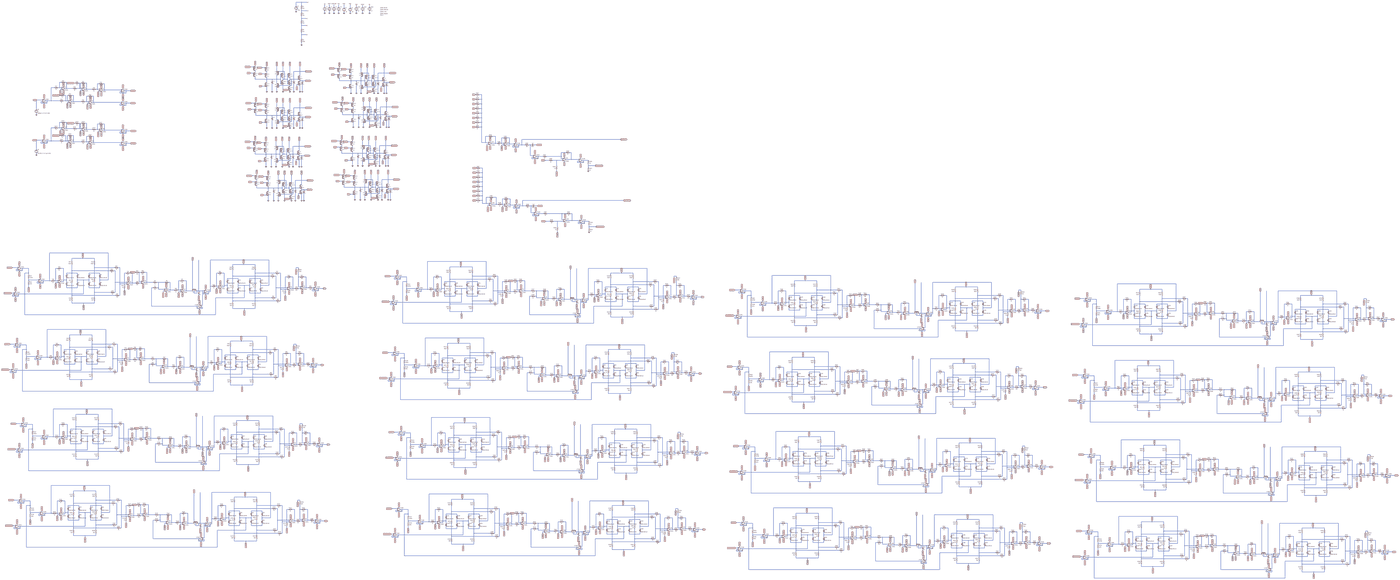
[diagram p0: schematic OZ_8_bounded_curves.asc, whole sheet]
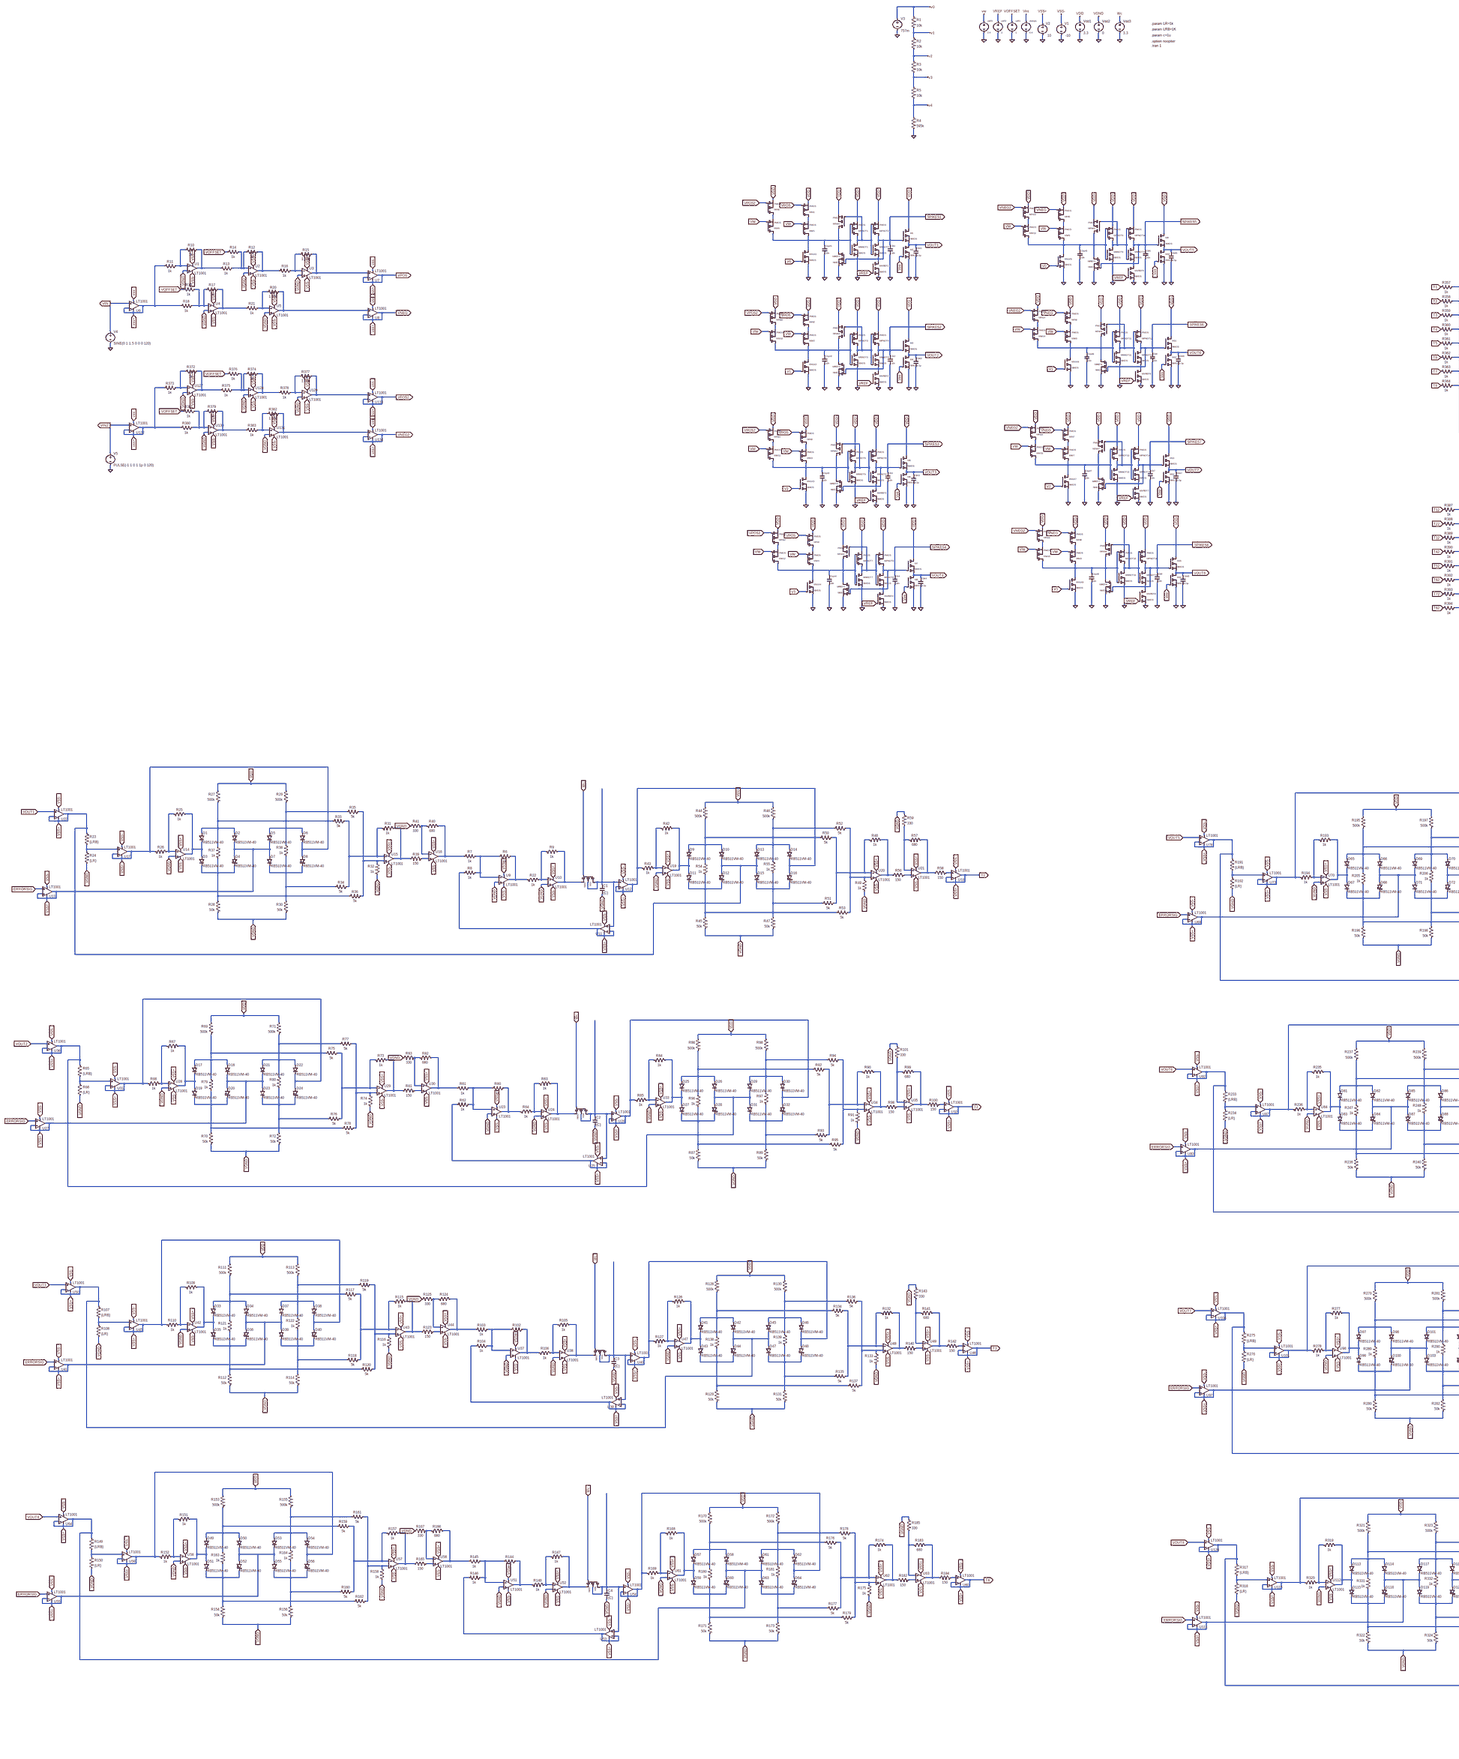
[diagram p1: schematic OZ_8_bounded_curves.asc, part, row 1 of 1, column 1 of 3]
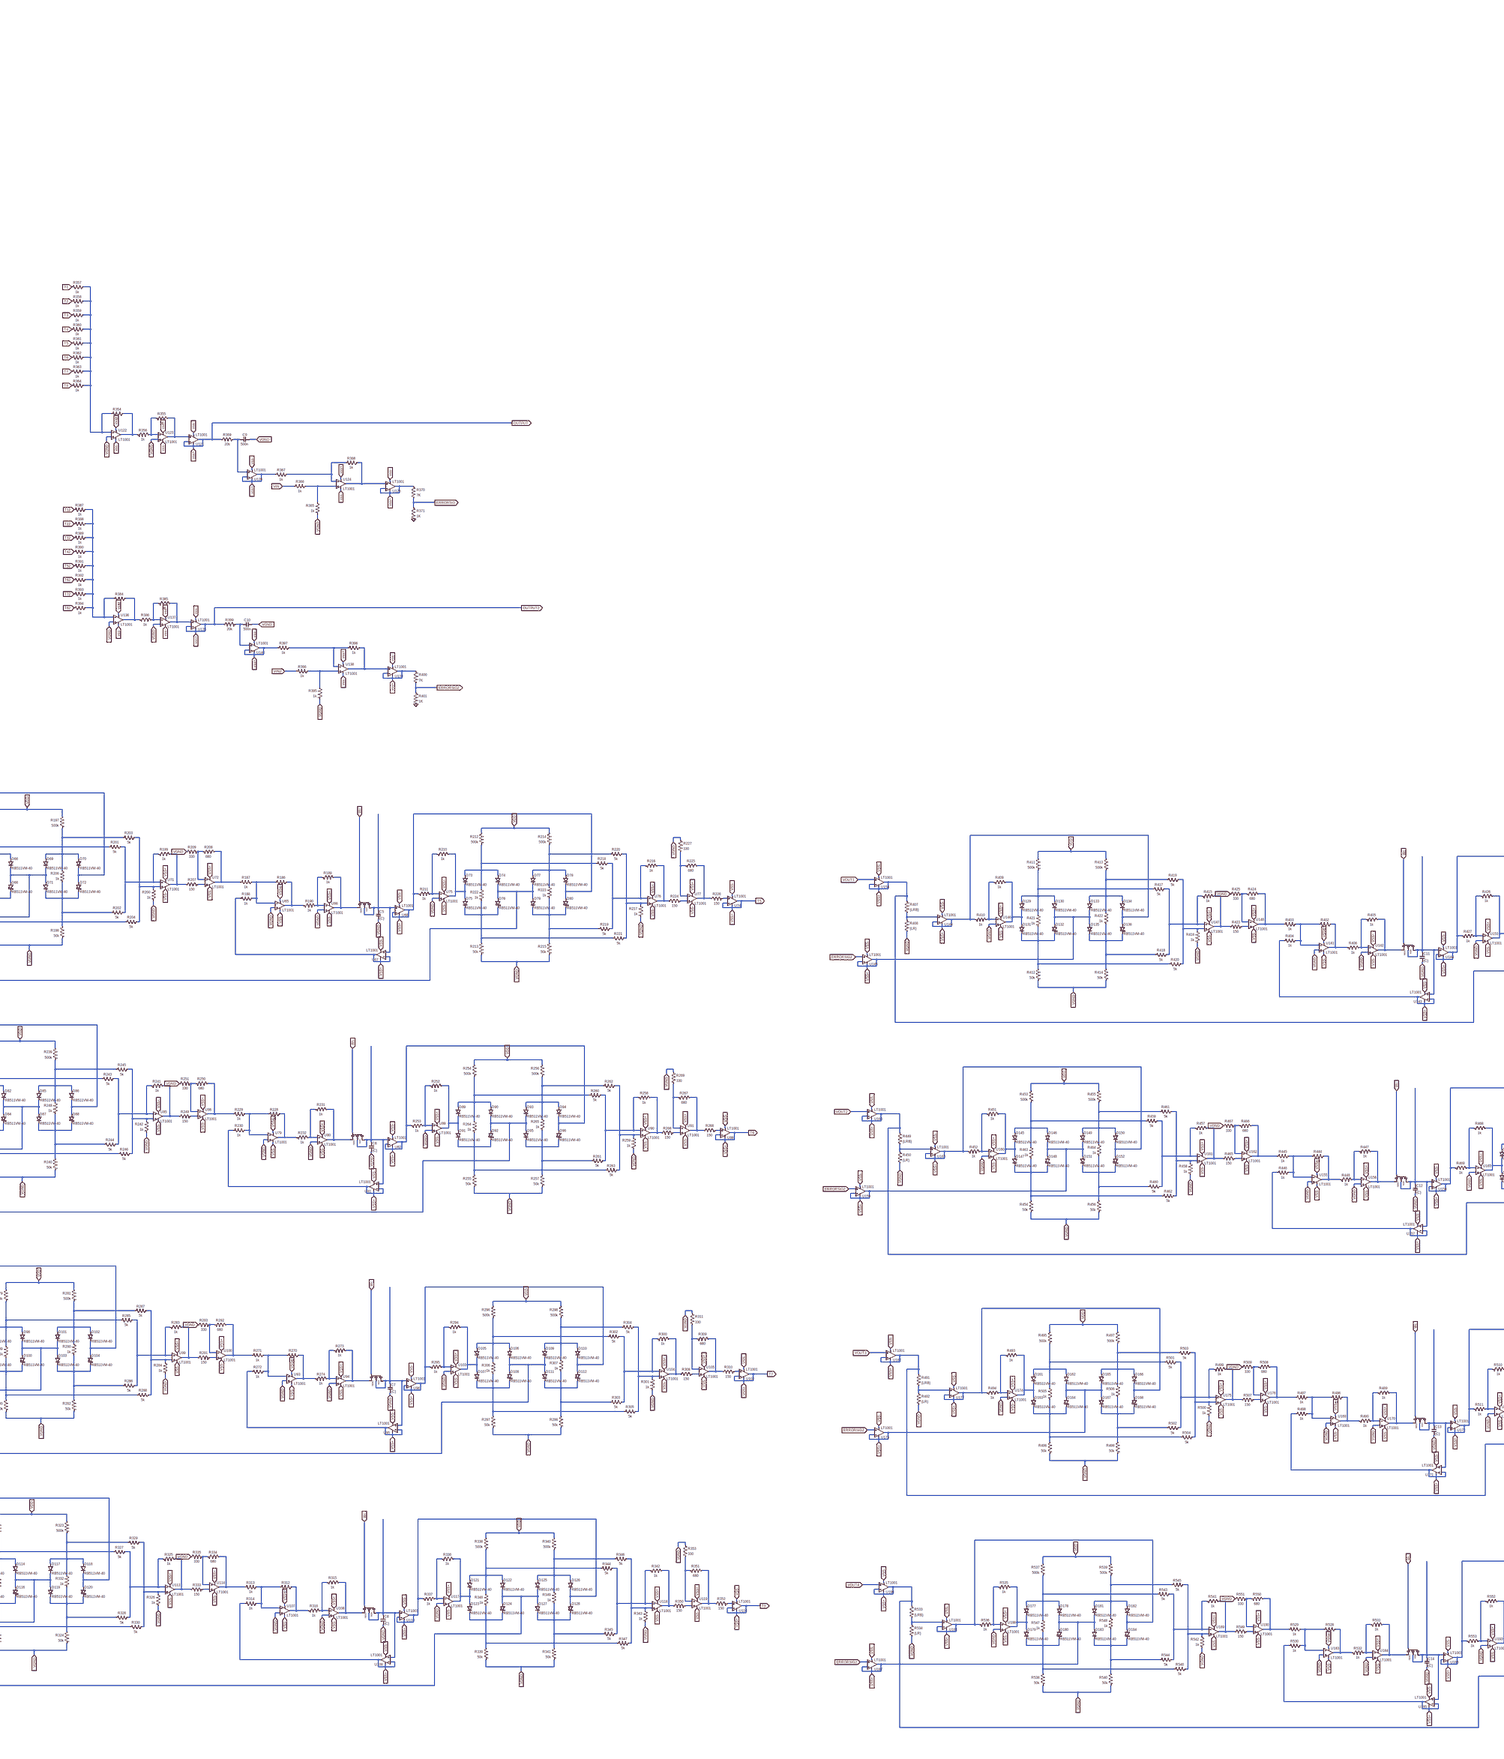
[diagram p2: schematic OZ_8_bounded_curves.asc, part, row 1 of 1, column 2 of 3]
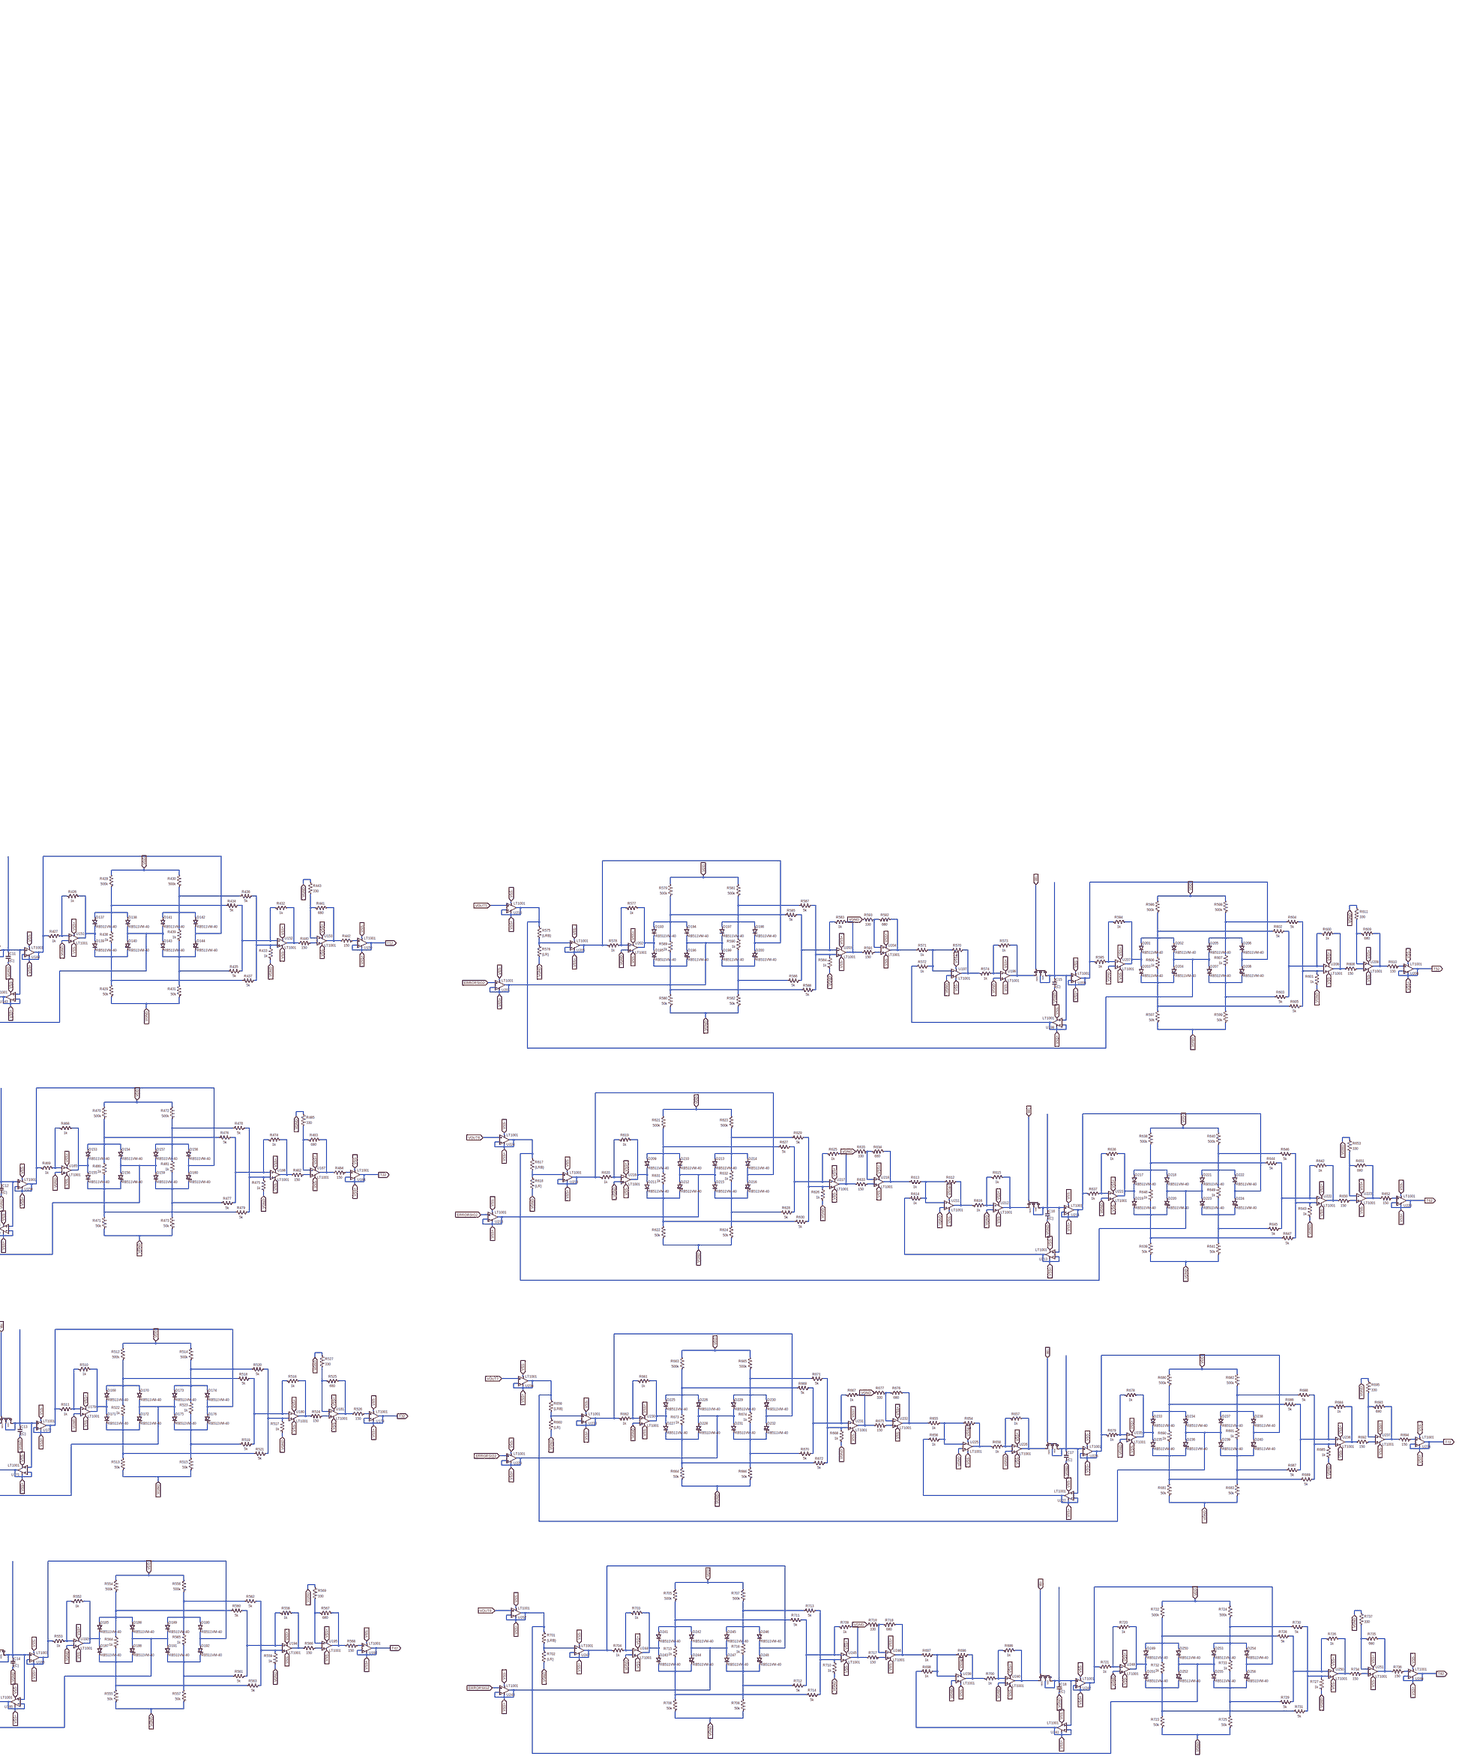
[diagram p3: schematic OZ_8_bounded_curves.asc, part, row 1 of 1, column 3 of 3]
* OZ_8_bounded_curves.asc
vtemp1 Vint 0 0.4
Vdd1 VDD 0 3.3
V1 VSS- 0 -10
V2 VSS+ 0 10
voff1 VOFFSET 0 1
voff2 VREF 0 2
voff3 vw 0 2.4
Vdd2 VGND 0 0
XU1 VGND N009 VSS+ VSS- N010 LT1001  ; pins In+ In- V+ V- OUT
R10 N010 N009 1k
R11 N009 N016 1k
XU2 VGND N011 VSS+ VSS- N012 LT1001  ; pins In+ In- V+ V- OUT
R12 N012 N011 1k
R13 N011 N010 1k
R14 N011 VOFFSET 1k
XU3 VGND N013 VSS+ VSS- N014 LT1001  ; pins In+ In- V+ V- OUT
R15 N014 N013 1.65k
R16 N013 N012 1k
XU4 VGND N019 VSS+ VSS- N020 LT1001  ; pins In+ In- V+ V- OUT
R17 N020 N019 1k
R18 N019 N016 1k
R19 N019 VOFFSET 1k
XU5 VGND N021 VSS+ VSS- N022 LT1001  ; pins In+ In- V+ V- OUT
R20 N022 N021 1.65k
R21 N021 N020 1k
XU6 VIN N016 VSS+ VSS- N016 LT1001  ; pins In+ In- V+ V- OUT
XU7 N014 VPOS VSS+ VSS- VPOS LT1001  ; pins In+ In- V+ V- OUT
XU8 N022 VNEG VSS+ VSS- VNEG LT1001  ; pins In+ In- V+ V- OUT
V3 v0 0 757m
R1 v0 v1 10k
R2 v1 v2 10k
R3 v2 v3 10k
R4 v4 0 595k
R5 v3 v4 10k
V4 VIN 0 SINE(0 1 1.5 0 0 0 120)
XU121 N046 OUTPUT VSS+ VSS- OUTPUT LT1001  ; pins In+ In- V+ V- OUT
XU122 VGND N018 VSS+ VSS- N044 LT1001  ; pins In+ In- V+ V- OUT
R354 N044 N018 1k
XU123 VGND N045 VSS+ VSS- N046 LT1001  ; pins In+ In- V+ V- OUT
R355 N045 N046 1k
R356 N044 N045 1k
R357 N018 T1 1k
R358 N018 T2 1k
R359 N018 T3 1k
R360 N018 T4 1k
R361 N018 T5 1k
R362 N018 T6 1k
R363 N018 T7 1k
R364 N018 T8 1k
M17 N146 Wc N117 N146 NMOS
C1 N146 VGND {C} IC=0
XU9 VGND N125 VSS+ VSS- N126 LT1001  ; pins In+ In- V+ V- OUT
R6 N126 N125 1k
R7 N125 N095 1k
R8 N125 N137 1k
XU10 VGND N116 VSS+ VSS- N117 LT1001  ; pins In+ In- V+ V- OUT
R9 N116 N117 1k
R22 N126 N116 1k
XU11 N146 N137 VSS+ VSS- N137 LT1001  ; pins In+ In- V+ V- OUT
XU12 N146 N084 VSS+ VSS- N084 LT1001  ; pins In+ In- V+ V- OUT
R23 N088 N114 {LRB}
R24 N114 VGND {LR}
XU13 ERRORSIG N115 VSS+ VSS- N115 LT1001  ; pins In+ In- V+ V- OUT
D1 N092 N090 RB511VM-40
XU14 VGND N089 VSS+ VSS- N090 LT1001  ; pins In+ In- V+ V- OUT
R25 N089 N090 1k
R26 N083 N089 1k
D2 N092 N115 RB511VM-40
D3 N090 N135 RB511VM-40
D4 N115 N135 RB511VM-40
R27 VDD N092 500k
R28 N135 VGND 50k
D5 N086 N115 RB511VM-40
D6 N086 N083 RB511VM-40
D7 N115 N136 RB511VM-40
D8 N083 N136 RB511VM-40
R29 VDD N086 500k
R30 N136 VGND 50k
XU15 N087 N093 VSS+ VSS- N096 LT1001  ; pins In+ In- V+ V- OUT
R31 N093 N096 1k
R32 VGND N087 1k
R33 N093 N092 5k
R34 N093 N136 5k
R35 N087 N086 5k
R36 N087 N135 5k
R37 N135 N092 1k
R38 N136 N086 1k
R39 N096 N128 150
XU16 N128 N094 VSS+ VSS- N095 LT1001  ; pins In+ In- V+ V- OUT
R40 N094 N095 680
R41 VGND N094 330
XU17 N114 N083 VSS+ VSS- N083 LT1001  ; pins In+ In- V+ V- OUT
XU18 N138 T1 VSS+ VSS- T1 LT1001  ; pins In+ In- V+ V- OUT
D9 N102 N098 RB511VM-40
XU19 VGND N097 VSS+ VSS- N098 LT1001  ; pins In+ In- V+ V- OUT
R42 N097 N098 1k
R43 N084 N097 1k
D10 N102 N088 RB511VM-40
D11 N098 N154 RB511VM-40
D12 N088 N154 RB511VM-40
R44 VDD N102 500k
R45 N154 VGND 50k
D13 N099 N088 RB511VM-40
D14 N099 N084 RB511VM-40
D15 N088 N155 RB511VM-40
D16 N084 N155 RB511VM-40
R46 VDD N099 500k
R47 N155 VGND 50k
XU20 N100 N103 VSS+ VSS- N106 LT1001  ; pins In+ In- V+ V- OUT
R48 N103 N106 1k
R49 VGND N100 1k
R50 N103 N102 5k
R51 N103 N155 5k
R52 N100 N099 5k
R53 N100 N154 5k
R54 N154 N102 1k
R55 N155 N099 1k
R56 N106 N139 150
XU21 N139 N107 VSS+ VSS- N108 LT1001  ; pins In+ In- V+ V- OUT
R57 N107 N108 680
R58 N108 N138 150
R59 VGND N107 330
XU22 VOUT1 N088 VSS+ VSS- N088 LT1001  ; pins In+ In- V+ V- OUT
M18 N290 Wc N261 N290 NMOS
C2 N290 VGND {C} IC=0
XU23 VGND N269 VSS+ VSS- N270 LT1001  ; pins In+ In- V+ V- OUT
R60 N270 N269 1k
R61 N269 N239 1k
R62 N269 N281 1k
XU24 VGND N260 VSS+ VSS- N261 LT1001  ; pins In+ In- V+ V- OUT
R63 N260 N261 1k
R64 N270 N260 1k
XU25 N290 N281 VSS+ VSS- N281 LT1001  ; pins In+ In- V+ V- OUT
XU26 N290 N228 VSS+ VSS- N228 LT1001  ; pins In+ In- V+ V- OUT
R65 N232 N258 {LRB}
R66 N258 VGND {LR}
XU27 ERRORSIG N259 VSS+ VSS- N259 LT1001  ; pins In+ In- V+ V- OUT
D17 N236 N234 RB511VM-40
XU28 VGND N233 VSS+ VSS- N234 LT1001  ; pins In+ In- V+ V- OUT
R67 N233 N234 1k
R68 N227 N233 1k
D18 N236 N259 RB511VM-40
D19 N234 N279 RB511VM-40
D20 N259 N279 RB511VM-40
R69 VDD N236 500k
R70 N279 VGND 50k
D21 N230 N259 RB511VM-40
D22 N230 N227 RB511VM-40
D23 N259 N280 RB511VM-40
D24 N227 N280 RB511VM-40
R71 VDD N230 500k
R72 N280 VGND 50k
XU29 N231 N237 VSS+ VSS- N240 LT1001  ; pins In+ In- V+ V- OUT
R73 N237 N240 1k
R74 VGND N231 1k
R75 N237 N236 5k
R76 N237 N280 5k
R77 N231 N230 5k
R78 N231 N279 5k
R79 N279 N236 1k
R80 N280 N230 1k
R81 N240 N272 150
XU30 N272 N238 VSS+ VSS- N239 LT1001  ; pins In+ In- V+ V- OUT
R82 N238 N239 680
R83 VGND N238 330
XU31 N258 N227 VSS+ VSS- N227 LT1001  ; pins In+ In- V+ V- OUT
XU32 N282 T2 VSS+ VSS- T2 LT1001  ; pins In+ In- V+ V- OUT
D25 N246 N242 RB511VM-40
XU33 VGND N241 VSS+ VSS- N242 LT1001  ; pins In+ In- V+ V- OUT
R84 N241 N242 1k
R85 N228 N241 1k
D26 N246 N232 RB511VM-40
D27 N242 N298 RB511VM-40
D28 N232 N298 RB511VM-40
R86 VDD N246 500k
R87 N298 VGND 50k
D29 N243 N232 RB511VM-40
D30 N243 N228 RB511VM-40
D31 N232 N299 RB511VM-40
D32 N228 N299 RB511VM-40
R88 VDD N243 500k
R89 N299 VGND 50k
XU34 N244 N247 VSS+ VSS- N250 LT1001  ; pins In+ In- V+ V- OUT
R90 N247 N250 1k
R91 VGND N244 1k
R92 N247 N246 5k
R93 N247 N299 5k
R94 N244 N243 5k
R95 N244 N298 5k
R96 N298 N246 1k
R97 N299 N243 1k
R98 N250 N283 150
XU35 N283 N251 VSS+ VSS- N252 LT1001  ; pins In+ In- V+ V- OUT
R99 N251 N252 680
R100 N252 N282 150
R101 VGND N251 330
XU36 VOUT2 N232 VSS+ VSS- N232 LT1001  ; pins In+ In- V+ V- OUT
M19 N434 Wc N405 N434 NMOS
C3 N434 VGND {C} IC=0
XU37 VGND N413 VSS+ VSS- N414 LT1001  ; pins In+ In- V+ V- OUT
R102 N414 N413 1k
R103 N413 N383 1k
R104 N413 N425 1k
XU38 VGND N404 VSS+ VSS- N405 LT1001  ; pins In+ In- V+ V- OUT
R105 N404 N405 1k
R106 N414 N404 1k
XU39 N434 N425 VSS+ VSS- N425 LT1001  ; pins In+ In- V+ V- OUT
XU40 N434 N372 VSS+ VSS- N372 LT1001  ; pins In+ In- V+ V- OUT
R107 N376 N402 {LRB}
R108 N402 VGND {LR}
XU41 ERRORSIG N403 VSS+ VSS- N403 LT1001  ; pins In+ In- V+ V- OUT
D33 N380 N378 RB511VM-40
XU42 VGND N377 VSS+ VSS- N378 LT1001  ; pins In+ In- V+ V- OUT
R109 N377 N378 1k
R110 N371 N377 1k
D34 N380 N403 RB511VM-40
D35 N378 N423 RB511VM-40
D36 N403 N423 RB511VM-40
R111 VDD N380 500k
R112 N423 VGND 50k
D37 N374 N403 RB511VM-40
D38 N374 N371 RB511VM-40
D39 N403 N424 RB511VM-40
D40 N371 N424 RB511VM-40
R113 VDD N374 500k
R114 N424 VGND 50k
XU43 N375 N381 VSS+ VSS- N384 LT1001  ; pins In+ In- V+ V- OUT
R115 N381 N384 1k
R116 VGND N375 1k
R117 N381 N380 5k
R118 N381 N424 5k
R119 N375 N374 5k
R120 N375 N423 5k
R121 N423 N380 1k
R122 N424 N374 1k
R123 N384 N416 150
XU44 N416 N382 VSS+ VSS- N383 LT1001  ; pins In+ In- V+ V- OUT
R124 N382 N383 680
R125 VGND N382 330
XU45 N402 N371 VSS+ VSS- N371 LT1001  ; pins In+ In- V+ V- OUT
XU46 N426 T3 VSS+ VSS- T3 LT1001  ; pins In+ In- V+ V- OUT
D41 N390 N386 RB511VM-40
XU47 VGND N385 VSS+ VSS- N386 LT1001  ; pins In+ In- V+ V- OUT
R126 N385 N386 1k
R127 N372 N385 1k
D42 N390 N376 RB511VM-40
D43 N386 N442 RB511VM-40
D44 N376 N442 RB511VM-40
R128 VDD N390 500k
R129 N442 VGND 50k
D45 N387 N376 RB511VM-40
D46 N387 N372 RB511VM-40
D47 N376 N443 RB511VM-40
D48 N372 N443 RB511VM-40
R130 VDD N387 500k
R131 N443 VGND 50k
XU48 N388 N391 VSS+ VSS- N394 LT1001  ; pins In+ In- V+ V- OUT
R132 N391 N394 1k
R133 VGND N388 1k
R134 N391 N390 5k
R135 N391 N443 5k
R136 N388 N387 5k
R137 N388 N442 5k
R138 N442 N390 1k
R139 N443 N387 1k
R140 N394 N427 150
XU49 N427 N395 VSS+ VSS- N396 LT1001  ; pins In+ In- V+ V- OUT
R141 N395 N396 680
R142 N396 N426 150
R143 VGND N395 330
XU50 VOUT3 N376 VSS+ VSS- N376 LT1001  ; pins In+ In- V+ V- OUT
M20 N578 Wc N549 N578 NMOS
C4 N578 VGND {C} IC=0
XU51 VGND N557 VSS+ VSS- N558 LT1001  ; pins In+ In- V+ V- OUT
R144 N558 N557 1k
R145 N557 N527 1k
R146 N557 N569 1k
XU52 VGND N548 VSS+ VSS- N549 LT1001  ; pins In+ In- V+ V- OUT
R147 N548 N549 1k
R148 N558 N548 1k
XU53 N578 N569 VSS+ VSS- N569 LT1001  ; pins In+ In- V+ V- OUT
XU54 N578 N516 VSS+ VSS- N516 LT1001  ; pins In+ In- V+ V- OUT
R149 N520 N546 {LRB}
R150 N546 VGND {LR}
XU55 ERRORSIG N547 VSS+ VSS- N547 LT1001  ; pins In+ In- V+ V- OUT
D49 N524 N522 RB511VM-40
XU56 VGND N521 VSS+ VSS- N522 LT1001  ; pins In+ In- V+ V- OUT
R151 N521 N522 1k
R152 N515 N521 1k
D50 N524 N547 RB511VM-40
D51 N522 N567 RB511VM-40
D52 N547 N567 RB511VM-40
R153 VDD N524 500k
R154 N567 VGND 50k
D53 N518 N547 RB511VM-40
D54 N518 N515 RB511VM-40
D55 N547 N568 RB511VM-40
D56 N515 N568 RB511VM-40
R155 VDD N518 500k
R156 N568 VGND 50k
XU57 N519 N525 VSS+ VSS- N528 LT1001  ; pins In+ In- V+ V- OUT
R157 N525 N528 1k
R158 VGND N519 1k
R159 N525 N524 5k
R160 N525 N568 5k
R161 N519 N518 5k
R162 N519 N567 5k
R163 N567 N524 1k
R164 N568 N518 1k
R165 N528 N560 150
XU58 N560 N526 VSS+ VSS- N527 LT1001  ; pins In+ In- V+ V- OUT
R166 N526 N527 680
R167 VGND N526 330
XU59 N546 N515 VSS+ VSS- N515 LT1001  ; pins In+ In- V+ V- OUT
XU60 N570 T4 VSS+ VSS- T4 LT1001  ; pins In+ In- V+ V- OUT
D57 N534 N530 RB511VM-40
XU61 VGND N529 VSS+ VSS- N530 LT1001  ; pins In+ In- V+ V- OUT
R168 N529 N530 1k
R169 N516 N529 1k
D58 N534 N520 RB511VM-40
D59 N530 N586 RB511VM-40
D60 N520 N586 RB511VM-40
R170 VDD N534 500k
R171 N586 VGND 50k
D61 N531 N520 RB511VM-40
D62 N531 N516 RB511VM-40
D63 N520 N587 RB511VM-40
D64 N516 N587 RB511VM-40
R172 VDD N531 500k
R173 N587 VGND 50k
XU62 N532 N535 VSS+ VSS- N538 LT1001  ; pins In+ In- V+ V- OUT
R174 N535 N538 1k
R175 VGND N532 1k
R176 N535 N534 5k
R177 N535 N587 5k
R178 N532 N531 5k
R179 N532 N586 5k
R180 N586 N534 1k
R181 N587 N531 1k
R182 N538 N571 150
XU63 N571 N539 VSS+ VSS- N540 LT1001  ; pins In+ In- V+ V- OUT
R183 N539 N540 680
R184 N540 N570 150
R185 VGND N539 330
XU64 VOUT4 N520 VSS+ VSS- N520 LT1001  ; pins In+ In- V+ V- OUT
M21 N174 Wc N143 N174 NMOS
C5 N174 VGND {C} IC=0
XU65 VGND N147 VSS+ VSS- N148 LT1001  ; pins In+ In- V+ V- OUT
R186 N148 N147 1k
R187 N147 N119 1k
R188 N147 N167 1k
XU66 VGND N142 VSS+ VSS- N143 LT1001  ; pins In+ In- V+ V- OUT
R189 N142 N143 1k
R190 N148 N142 1k
XU67 N174 N167 VSS+ VSS- N167 LT1001  ; pins In+ In- V+ V- OUT
XU68 N174 N091 VSS+ VSS- N091 LT1001  ; pins In+ In- V+ V- OUT
R191 N109 N140 {LRB}
R192 N140 VGND {LR}
XU69 ERRORSIG N141 VSS+ VSS- N141 LT1001  ; pins In+ In- V+ V- OUT
D65 N112 N111 RB511VM-40
XU70 VGND N110 VSS+ VSS- N111 LT1001  ; pins In+ In- V+ V- OUT
R193 N110 N111 1k
R194 N085 N110 1k
D66 N112 N141 RB511VM-40
D67 N111 N165 RB511VM-40
D68 N141 N165 RB511VM-40
R195 VDD N112 500k
R196 N165 VGND 50k
D69 N104 N141 RB511VM-40
D70 N104 N085 RB511VM-40
D71 N141 N166 RB511VM-40
D72 N085 N166 RB511VM-40
R197 VDD N104 500k
R198 N166 VGND 50k
XU71 N105 N113 VSS+ VSS- N120 LT1001  ; pins In+ In- V+ V- OUT
R199 N113 N120 1k
R200 VGND N105 1k
R201 N113 N112 5k
R202 N113 N166 5k
R203 N105 N104 5k
R204 N105 N165 5k
R205 N165 N112 1k
R206 N166 N104 1k
R207 N120 N153 150
XU72 N153 N118 VSS+ VSS- N119 LT1001  ; pins In+ In- V+ V- OUT
R208 N118 N119 680
R209 VGND N118 330
XU73 N140 N085 VSS+ VSS- N085 LT1001  ; pins In+ In- V+ V- OUT
XU74 N168 T5 VSS+ VSS- T5 LT1001  ; pins In+ In- V+ V- OUT
D73 N130 N122 RB511VM-40
XU75 VGND N121 VSS+ VSS- N122 LT1001  ; pins In+ In- V+ V- OUT
R210 N121 N122 1k
R211 N091 N121 1k
D74 N130 N109 RB511VM-40
D75 N122 N181 RB511VM-40
D76 N109 N181 RB511VM-40
R212 VDD N130 500k
R213 N181 VGND 50k
D77 N123 N109 RB511VM-40
D78 N123 N091 RB511VM-40
D79 N109 N182 RB511VM-40
D80 N091 N182 RB511VM-40
R214 VDD N123 500k
R215 N182 VGND 50k
XU76 N124 N131 VSS+ VSS- N132 LT1001  ; pins In+ In- V+ V- OUT
R216 N131 N132 1k
R217 VGND N124 1k
R218 N131 N130 5k
R219 N131 N182 5k
R220 N124 N123 5k
R221 N124 N181 5k
R222 N181 N130 1k
R223 N182 N123 1k
R224 N132 N169 150
XU77 N169 N133 VSS+ VSS- N134 LT1001  ; pins In+ In- V+ V- OUT
R225 N133 N134 680
R226 N134 N168 150
R227 VGND N133 330
XU78 VOUT5 N109 VSS+ VSS- N109 LT1001  ; pins In+ In- V+ V- OUT
M22 N318 Wc N287 N318 NMOS
C6 N318 VGND {C} IC=0
XU79 VGND N291 VSS+ VSS- N292 LT1001  ; pins In+ In- V+ V- OUT
R228 N292 N291 1k
R229 N291 N263 1k
R230 N291 N311 1k
XU80 VGND N286 VSS+ VSS- N287 LT1001  ; pins In+ In- V+ V- OUT
R231 N286 N287 1k
R232 N292 N286 1k
XU81 N318 N311 VSS+ VSS- N311 LT1001  ; pins In+ In- V+ V- OUT
XU82 N318 N235 VSS+ VSS- N235 LT1001  ; pins In+ In- V+ V- OUT
R233 N253 N284 {LRB}
R234 N284 VGND {LR}
XU83 ERRORSIG N285 VSS+ VSS- N285 LT1001  ; pins In+ In- V+ V- OUT
D81 N256 N255 RB511VM-40
XU84 VGND N254 VSS+ VSS- N255 LT1001  ; pins In+ In- V+ V- OUT
R235 N254 N255 1k
R236 N229 N254 1k
D82 N256 N285 RB511VM-40
D83 N255 N309 RB511VM-40
D84 N285 N309 RB511VM-40
R237 VDD N256 500k
R238 N309 VGND 50k
D85 N248 N285 RB511VM-40
D86 N248 N229 RB511VM-40
D87 N285 N310 RB511VM-40
D88 N229 N310 RB511VM-40
R239 VDD N248 500k
R240 N310 VGND 50k
XU85 N249 N257 VSS+ VSS- N264 LT1001  ; pins In+ In- V+ V- OUT
R241 N257 N264 1k
R242 VGND N249 1k
R243 N257 N256 5k
R244 N257 N310 5k
R245 N249 N248 5k
R246 N249 N309 5k
R247 N309 N256 1k
R248 N310 N248 1k
R249 N264 N297 150
XU86 N297 N262 VSS+ VSS- N263 LT1001  ; pins In+ In- V+ V- OUT
R250 N262 N263 680
R251 VGND N262 330
XU87 N284 N229 VSS+ VSS- N229 LT1001  ; pins In+ In- V+ V- OUT
XU88 N312 T6 VSS+ VSS- T6 LT1001  ; pins In+ In- V+ V- OUT
D89 N274 N266 RB511VM-40
XU89 VGND N265 VSS+ VSS- N266 LT1001  ; pins In+ In- V+ V- OUT
R252 N265 N266 1k
R253 N235 N265 1k
D90 N274 N253 RB511VM-40
D91 N266 N325 RB511VM-40
D92 N253 N325 RB511VM-40
R254 VDD N274 500k
R255 N325 VGND 50k
D93 N267 N253 RB511VM-40
D94 N267 N235 RB511VM-40
D95 N253 N326 RB511VM-40
D96 N235 N326 RB511VM-40
R256 VDD N267 500k
R257 N326 VGND 50k
XU90 N268 N275 VSS+ VSS- N276 LT1001  ; pins In+ In- V+ V- OUT
R258 N275 N276 1k
R259 VGND N268 1k
R260 N275 N274 5k
R261 N275 N326 5k
R262 N268 N267 5k
R263 N268 N325 5k
R264 N325 N274 1k
R265 N326 N267 1k
R266 N276 N313 150
XU91 N313 N277 VSS+ VSS- N278 LT1001  ; pins In+ In- V+ V- OUT
R267 N277 N278 680
R268 N278 N312 150
R269 VGND N277 330
XU92 VOUT6 N253 VSS+ VSS- N253 LT1001  ; pins In+ In- V+ V- OUT
M23 N462 Wc N431 N462 NMOS
C7 N462 VGND {C} IC=0
XU93 VGND N435 VSS+ VSS- N436 LT1001  ; pins In+ In- V+ V- OUT
R270 N436 N435 1k
R271 N435 N407 1k
R272 N435 N455 1k
XU94 VGND N430 VSS+ VSS- N431 LT1001  ; pins In+ In- V+ V- OUT
R273 N430 N431 1k
R274 N436 N430 1k
XU95 N462 N455 VSS+ VSS- N455 LT1001  ; pins In+ In- V+ V- OUT
XU96 N462 N379 VSS+ VSS- N379 LT1001  ; pins In+ In- V+ V- OUT
R275 N397 N428 {LRB}
R276 N428 VGND {LR}
XU97 ERRORSIG N429 VSS+ VSS- N429 LT1001  ; pins In+ In- V+ V- OUT
D97 N400 N399 RB511VM-40
XU98 VGND N398 VSS+ VSS- N399 LT1001  ; pins In+ In- V+ V- OUT
R277 N398 N399 1k
R278 N373 N398 1k
D98 N400 N429 RB511VM-40
D99 N399 N453 RB511VM-40
D100 N429 N453 RB511VM-40
R279 VDD N400 500k
R280 N453 VGND 50k
D101 N392 N429 RB511VM-40
D102 N392 N373 RB511VM-40
D103 N429 N454 RB511VM-40
D104 N373 N454 RB511VM-40
R281 VDD N392 500k
R282 N454 VGND 50k
XU99 N393 N401 VSS+ VSS- N408 LT1001  ; pins In+ In- V+ V- OUT
R283 N401 N408 1k
R284 VGND N393 1k
R285 N401 N400 5k
R286 N401 N454 5k
R287 N393 N392 5k
R288 N393 N453 5k
R289 N453 N400 1k
R290 N454 N392 1k
R291 N408 N441 150
XU100 N441 N406 VSS+ VSS- N407 LT1001  ; pins In+ In- V+ V- OUT
R292 N406 N407 680
R293 VGND N406 330
XU101 N428 N373 VSS+ VSS- N373 LT1001  ; pins In+ In- V+ V- OUT
XU102 N456 T7 VSS+ VSS- T7 LT1001  ; pins In+ In- V+ V- OUT
D105 N418 N410 RB511VM-40
XU103 VGND N409 VSS+ VSS- N410 LT1001  ; pins In+ In- V+ V- OUT
R294 N409 N410 1k
R295 N379 N409 1k
D106 N418 N397 RB511VM-40
D107 N410 N469 RB511VM-40
D108 N397 N469 RB511VM-40
R296 VDD N418 500k
R297 N469 VGND 50k
D109 N411 N397 RB511VM-40
D110 N411 N379 RB511VM-40
D111 N397 N470 RB511VM-40
D112 N379 N470 RB511VM-40
R298 VDD N411 500k
R299 N470 VGND 50k
XU104 N412 N419 VSS+ VSS- N420 LT1001  ; pins In+ In- V+ V- OUT
R300 N419 N420 1k
R301 VGND N412 1k
R302 N419 N418 5k
R303 N419 N470 5k
R304 N412 N411 5k
R305 N412 N469 5k
R306 N469 N418 1k
R307 N470 N411 1k
R308 N420 N457 150
XU105 N457 N421 VSS+ VSS- N422 LT1001  ; pins In+ In- V+ V- OUT
R309 N421 N422 680
R310 N422 N456 150
R311 VGND N421 330
XU106 VOUT7 N397 VSS+ VSS- N397 LT1001  ; pins In+ In- V+ V- OUT
M24 N606 Wc N575 N606 NMOS
C8 N606 VGND {C} IC=0
XU107 VGND N579 VSS+ VSS- N580 LT1001  ; pins In+ In- V+ V- OUT
R312 N580 N579 1k
R313 N579 N551 1k
R314 N579 N599 1k
XU108 VGND N574 VSS+ VSS- N575 LT1001  ; pins In+ In- V+ V- OUT
R315 N574 N575 1k
R316 N580 N574 1k
XU109 N606 N599 VSS+ VSS- N599 LT1001  ; pins In+ In- V+ V- OUT
XU110 N606 N523 VSS+ VSS- N523 LT1001  ; pins In+ In- V+ V- OUT
R317 N541 N572 {LRB}
R318 N572 VGND {LR}
XU111 ERRORSIG N573 VSS+ VSS- N573 LT1001  ; pins In+ In- V+ V- OUT
D113 N544 N543 RB511VM-40
XU112 VGND N542 VSS+ VSS- N543 LT1001  ; pins In+ In- V+ V- OUT
R319 N542 N543 1k
R320 N517 N542 1k
D114 N544 N573 RB511VM-40
D115 N543 N597 RB511VM-40
D116 N573 N597 RB511VM-40
R321 VDD N544 500k
R322 N597 VGND 50k
D117 N536 N573 RB511VM-40
D118 N536 N517 RB511VM-40
D119 N573 N598 RB511VM-40
D120 N517 N598 RB511VM-40
R323 VDD N536 500k
R324 N598 VGND 50k
XU113 N537 N545 VSS+ VSS- N552 LT1001  ; pins In+ In- V+ V- OUT
R325 N545 N552 1k
R326 VGND N537 1k
R327 N545 N544 5k
R328 N545 N598 5k
R329 N537 N536 5k
R330 N537 N597 5k
R331 N597 N544 1k
R332 N598 N536 1k
R333 N552 N585 150
XU114 N585 N550 VSS+ VSS- N551 LT1001  ; pins In+ In- V+ V- OUT
R334 N550 N551 680
R335 VGND N550 330
XU115 N572 N517 VSS+ VSS- N517 LT1001  ; pins In+ In- V+ V- OUT
XU116 N600 T8 VSS+ VSS- T8 LT1001  ; pins In+ In- V+ V- OUT
D121 N562 N554 RB511VM-40
XU117 VGND N553 VSS+ VSS- N554 LT1001  ; pins In+ In- V+ V- OUT
R336 N553 N554 1k
R337 N523 N553 1k
D122 N562 N541 RB511VM-40
D123 N554 N613 RB511VM-40
D124 N541 N613 RB511VM-40
R338 VDD N562 500k
R339 N613 VGND 50k
D125 N555 N541 RB511VM-40
D126 N555 N523 RB511VM-40
D127 N541 N614 RB511VM-40
D128 N523 N614 RB511VM-40
R340 VDD N555 500k
R341 N614 VGND 50k
XU118 N556 N563 VSS+ VSS- N564 LT1001  ; pins In+ In- V+ V- OUT
R342 N563 N564 1k
R343 VGND N556 1k
R344 N563 N562 5k
R345 N563 N614 5k
R346 N556 N555 5k
R347 N556 N613 5k
R348 N613 N562 1k
R349 N614 N555 1k
R350 N564 N601 150
XU119 N601 N565 VSS+ VSS- N566 LT1001  ; pins In+ In- V+ V- OUT
R351 N565 N566 680
R352 N566 N600 150
R353 VGND N565 330
XU120 VOUT8 N541 VSS+ VSS- N541 LT1001  ; pins In+ In- V+ V- OUT
XU124 N060 N054 VSS+ VSS- N055 LT1001  ; pins In+ In- V+ V- OUT
R365 VGND N060 1k
R366 N060 VIN 1k
R367 N054 N058 1k
R368 N055 N054 1k
XU125 N055 N061 VSS+ VSS- N061 LT1001  ; pins In+ In- V+ V- OUT
R369 OUTPUT N047 20k
C9 N047 VGND 500n
XU126 N047 N058 VSS+ VSS- N058 LT1001  ; pins In+ In- V+ V- OUT
R370 N061 ERRORSIG 7K
R371 ERRORSIG 0 1K
Vdd3 Wc 0 3.3
XU127 VGND N032 VSS+ VSS- N033 LT1001  ; pins In+ In- V+ V- OUT
R372 N033 N032 1k
R373 N032 N039 1k
XU128 VGND N035 VSS+ VSS- N036 LT1001  ; pins In+ In- V+ V- OUT
R374 N036 N035 1k
R375 N035 N033 1k
R376 N035 VOFFSET 1k
XU129 VGND N037 VSS+ VSS- N038 LT1001  ; pins In+ In- V+ V- OUT
R377 N038 N037 1.65k
R378 N037 N036 1k
XU130 VGND N040 VSS+ VSS- N041 LT1001  ; pins In+ In- V+ V- OUT
R379 N041 N040 1k
R380 N040 N039 1k
R381 N040 VOFFSET 1k
XU131 VGND N042 VSS+ VSS- N043 LT1001  ; pins In+ In- V+ V- OUT
R382 N043 N042 1.65k
R383 N042 N041 1k
XU132 VIN2 N039 VSS+ VSS- N039 LT1001  ; pins In+ In- V+ V- OUT
XU133 N038 VPOS2 VSS+ VSS- VPOS2 LT1001  ; pins In+ In- V+ V- OUT
XU134 N043 VNEG2 VSS+ VSS- VNEG2 LT1001  ; pins In+ In- V+ V- OUT
V5 VIN2 0 PULSE(-1 1 0 1 1p 0 120)
MW1 N007 vw N003 N003 PMOS
Csyn1 N007 0 10n V=4 Irms=162m Rser=0.395426 Lser=0 mfg="KEMET" pn="C0402C103K7PAC" type="X5R" IC=0
Ck1 SPIKES1 0 10n
MPNOT1 N001 N007 VDD VDD PMOS
MNNOT1 N001 N007 0 0 NMOS
MVREF1 N015 VREF 0 0 NMOS
MREF1 N007 SPIKES1 0 0 NMOS
MVLK1 N007 v0 0 0 NMOS
MINA1 N007 N001 VDD VDD PMOS
MIN1 N003 VPOS VDD VDD PMOS
MPNOT2 SPIKES1 N001 VDD VDD PMOS
MNNOT2 SPIKES1 N001 N015 N015 NMOS
M1 VDD SPIKES1 VOUT1 VOUT1 NMOS
M2 VOUT1 Vint 0 0 NMOS
Cint1 VOUT1 0 0.1µ
MW2 N030 vw N028 N028 PMOS
Csyn2 N030 0 10n V=4 Irms=162m Rser=0.395426 Lser=0 mfg="KEMET" pn="C0402C103K7PAC" type="X5R" IC=0
Ck2 SPIKES2 0 10n
MPNOT3 N024 N030 VDD VDD PMOS
MNNOT3 N024 N030 0 0 NMOS
MVREF2 N034 VREF 0 0 NMOS
MREF2 N030 SPIKES2 0 0 NMOS
MVLK2 N030 v1 0 0 NMOS
MINA2 N030 N024 VDD VDD PMOS
MIN2 N028 VPOS VDD VDD PMOS
MPNOT4 SPIKES2 N024 VDD VDD PMOS
MNNOT4 SPIKES2 N024 N034 N034 NMOS
M3 VDD SPIKES2 VOUT2 VOUT2 NMOS
M4 VOUT2 Vint 0 0 NMOS
Cint2 VOUT2 0 0.1µ
MW3 N057 vw N053 N053 PMOS
Csyn3 N057 0 10n V=4 Irms=162m Rser=0.395426 Lser=0 mfg="KEMET" pn="C0402C103K7PAC" type="X5R" IC=0
Ck3 SPIKES3 0 10n
MPNOT5 N049 N057 VDD VDD PMOS
MNNOT5 N049 N057 0 0 NMOS
MVREF3 N062 VREF 0 0 NMOS
MREF3 N057 SPIKES3 0 0 NMOS
MVLK3 N057 v2 0 0 NMOS
MINA3 N057 N049 VDD VDD PMOS
MIN3 N053 VPOS VDD VDD PMOS
MPNOT6 SPIKES3 N049 VDD VDD PMOS
MNNOT6 SPIKES3 N049 N062 N062 NMOS
M5 VDD SPIKES3 VOUT3 VOUT3 NMOS
M6 VOUT3 Vint 0 0 NMOS
Cint3 VOUT3 0 0.1µ
MW4 N071 vw N069 N069 PMOS
Csyn4 N071 0 10n V=4 Irms=162m Rser=0.395426 Lser=0 mfg="KEMET" pn="C0402C103K7PAC" type="X5R" IC=0
Ck4 SPIKES4 0 10n
MPNOT7 N065 N071 VDD VDD PMOS
MNNOT7 N065 N071 0 0 NMOS
MVREF4 N073 VREF 0 0 NMOS
MREF4 N071 SPIKES4 0 0 NMOS
MVLK4 N071 v3 0 0 NMOS
MINA4 N071 N065 VDD VDD PMOS
MIN4 N069 VPOS VDD VDD PMOS
MPNOT8 SPIKES4 N065 VDD VDD PMOS
MNNOT8 SPIKES4 N065 N073 N073 NMOS
M7 VDD SPIKES4 VOUT4 VOUT4 NMOS
M8 VOUT4 Vint 0 0 NMOS
Cint4 VOUT4 0 0.1µ
MW5 N008 vw N006 N006 PMOS
Csyn5 N008 0 10n V=4 Irms=162m Rser=0.395426 Lser=0 mfg="KEMET" pn="C0402C103K7PAC" type="X5R" IC=0
Ck5 SPIKES5 0 10n
MPNOT9 N004 N008 VDD VDD PMOS
MNNOT9 N004 N008 0 0 NMOS
MVREF5 N017 VREF 0 0 NMOS
MREF5 N008 SPIKES5 0 0 NMOS
MVLK5 N008 v0 0 0 NMOS
MINA5 N008 N004 VDD VDD PMOS
MIN5 N006 VNEG VDD VDD PMOS
MPNOT10 SPIKES5 N004 VDD VDD PMOS
MNNOT10 SPIKES5 N004 N017 N017 NMOS
M9 VDD SPIKES5 VOUT5 VOUT5 NMOS
M10 VOUT5 Vint 0 0 NMOS
Cint5 VOUT5 0 0.1µ
MW6 N029 vw N027 N027 PMOS
Csyn6 N029 0 10n V=4 Irms=162m Rser=0.395426 Lser=0 mfg="KEMET" pn="C0402C103K7PAC" type="X5R" IC=0
Ck6 SPIKES6 0 10n
MPNOT11 N023 N029 VDD VDD PMOS
MNNOT11 N023 N029 0 0 NMOS
MVREF6 N031 VREF 0 0 NMOS
MREF6 N029 SPIKES6 0 0 NMOS
MVLK6 N029 v1 0 0 NMOS
MINA6 N029 N023 VDD VDD PMOS
MIN6 N027 VNEG VDD VDD PMOS
MPNOT12 SPIKES6 N023 VDD VDD PMOS
MNNOT12 SPIKES6 N023 N031 N031 NMOS
M11 VDD SPIKES6 VOUT6 VOUT6 NMOS
M12 VOUT6 Vint 0 0 NMOS
Cint6 VOUT6 0 0.1µ
MW7 N056 vw N052 N052 PMOS
Csyn7 N056 0 10n V=4 Irms=162m Rser=0.395426 Lser=0 mfg="KEMET" pn="C0402C103K7PAC" type="X5R" IC=0
Ck7 SPIKES7 0 10n
MPNOT13 N048 N056 VDD VDD PMOS
MNNOT13 N048 N056 0 0 NMOS
MVREF7 N059 VREF 0 0 NMOS
MREF7 N056 SPIKES7 0 0 NMOS
MVLK7 N056 v2 0 0 NMOS
MINA7 N056 N048 VDD VDD PMOS
MIN7 N052 VNEG VDD VDD PMOS
MPNOT14 SPIKES7 N048 VDD VDD PMOS
MNNOT14 SPIKES7 N048 N059 N059 NMOS
M13 VDD SPIKES7 VOUT7 VOUT7 NMOS
M14 VOUT7 Vint 0 0 NMOS
Cint7 VOUT7 0 0.1µ
MW8 N070 vw N068 N068 PMOS
Csyn8 N070 0 10n V=4 Irms=162m Rser=0.395426 Lser=0 mfg="KEMET" pn="C0402C103K7PAC" type="X5R" IC=0
Ck8 SPIKES8 0 10n
MPNOT15 N064 N070 VDD VDD PMOS
MNNOT15 N064 N070 0 0 NMOS
MVREF8 N072 VREF 0 0 NMOS
MREF8 N070 SPIKES8 0 0 NMOS
MVLK8 N070 v3 0 0 NMOS
MINA8 N070 N064 VDD VDD PMOS
MIN8 N068 VNEG VDD VDD PMOS
MPNOT16 SPIKES8 N064 VDD VDD PMOS
MNNOT16 SPIKES8 N064 N072 N072 NMOS
M15 VDD SPIKES8 VOUT8 VOUT8 NMOS
M16 VOUT8 Vint 0 0 NMOS
Cint8 VOUT8 0 0.1µ
MW9 N007 vw N002 N002 PMOS
MIN9 N002 VPOS2 VDD VDD PMOS
MW10 N030 vw N026 N026 PMOS
MIN10 N026 VPOS2 VDD VDD PMOS
MW11 N057 vw N051 N051 PMOS
MIN11 N051 VPOS2 VDD VDD PMOS
MW12 N071 vw N067 N067 PMOS
MIN12 N067 VPOS2 VDD VDD PMOS
MW13 N008 vw N005 N005 PMOS
MIN13 N005 VNEG2 VDD VDD PMOS
MW14 N029 vw N025 N025 PMOS
MIN14 N025 VNEG2 VDD VDD PMOS
MW15 N056 vw N050 N050 PMOS
MIN15 N050 VNEG2 VDD VDD PMOS
MW16 N070 vw N066 N066 PMOS
MIN16 N066 VNEG2 VDD VDD PMOS
XU135 N076 OUTPUT2 VSS+ VSS- OUTPUT2 LT1001  ; pins In+ In- V+ V- OUT
XU136 VGND N063 VSS+ VSS- N074 LT1001  ; pins In+ In- V+ V- OUT
R384 N074 N063 1k
XU137 VGND N075 VSS+ VSS- N076 LT1001  ; pins In+ In- V+ V- OUT
R385 N075 N076 1k
R386 N074 N075 1k
R387 N063 T12 1k
R388 N063 T22 1k
R389 N063 T32 1k
R390 N063 T42 1k
R391 N063 T52 1k
R392 N063 T62 1k
R393 N063 T72 1k
R394 N063 T82 1k
XU138 N081 N079 VSS+ VSS- N080 LT1001  ; pins In+ In- V+ V- OUT
R395 VGND N081 1k
R396 N081 VIN2 1k
R397 N079 N078 1k
R398 N080 N079 1k
XU139 N080 N082 VSS+ VSS- N082 LT1001  ; pins In+ In- V+ V- OUT
R399 OUTPUT2 N077 20k
C10 N077 VGND 500n
XU140 N077 N078 VSS+ VSS- N078 LT1001  ; pins In+ In- V+ V- OUT
R400 N082 ERRORSIG2 7K
R401 ERRORSIG2 0 1K
M25 N213 Wc N188 N213 NMOS
C11 N213 VGND {C} IC=0
XU141 VGND N196 VSS+ VSS- N197 LT1001  ; pins In+ In- V+ V- OUT
R402 N197 N196 1k
R403 N196 N159 1k
R404 N196 N206 1k
XU142 VGND N187 VSS+ VSS- N188 LT1001  ; pins In+ In- V+ V- OUT
R405 N187 N188 1k
R406 N197 N187 1k
XU143 N213 N206 VSS+ VSS- N206 LT1001  ; pins In+ In- V+ V- OUT
XU144 N213 N127 VSS+ VSS- N127 LT1001  ; pins In+ In- V+ V- OUT
R407 N149 N185 {LRB}
R408 N185 VGND {LR}
XU145 ERRORSIG2 N186 VSS+ VSS- N186 LT1001  ; pins In+ In- V+ V- OUT
D129 N156 N151 RB511VM-40
XU146 VGND N150 VSS+ VSS- N151 LT1001  ; pins In+ In- V+ V- OUT
R409 N150 N151 1k
R410 N101 N150 1k
D130 N156 N186 RB511VM-40
D131 N151 N204 RB511VM-40
D132 N186 N204 RB511VM-40
R411 VDD N156 500k
R412 N204 VGND 50k
D133 N144 N186 RB511VM-40
D134 N144 N101 RB511VM-40
D135 N186 N205 RB511VM-40
D136 N101 N205 RB511VM-40
R413 VDD N144 500k
R414 N205 VGND 50k
XU147 N145 N157 VSS+ VSS- N160 LT1001  ; pins In+ In- V+ V- OUT
R415 N157 N160 1k
R416 VGND N145 1k
R417 N157 N156 5k
R418 N157 N205 5k
R419 N145 N144 5k
R420 N145 N204 5k
R421 N204 N156 1k
R422 N205 N144 1k
R423 N160 N198 150
XU148 N198 N158 VSS+ VSS- N159 LT1001  ; pins In+ In- V+ V- OUT
R424 N158 N159 680
R425 VGND N158 330
XU149 N185 N101 VSS+ VSS- N101 LT1001  ; pins In+ In- V+ V- OUT
XU150 N207 T12 VSS+ VSS- T12 LT1001  ; pins In+ In- V+ V- OUT
D137 N170 N162 RB511VM-40
XU151 VGND N161 VSS+ VSS- N162 LT1001  ; pins In+ In- V+ V- OUT
R426 N161 N162 1k
R427 N127 N161 1k
D138 N170 N149 RB511VM-40
D139 N162 N217 RB511VM-40
D140 N149 N217 RB511VM-40
R428 VDD N170 500k
R429 N217 VGND 50k
D141 N163 N149 RB511VM-40
D142 N163 N127 RB511VM-40
D143 N149 N218 RB511VM-40
D144 N127 N218 RB511VM-40
R430 VDD N163 500k
R431 N218 VGND 50k
XU152 N164 N171 VSS+ VSS- N175 LT1001  ; pins In+ In- V+ V- OUT
R432 N171 N175 1k
R433 VGND N164 1k
R434 N171 N170 5k
R435 N171 N218 5k
R436 N164 N163 5k
R437 N164 N217 5k
R438 N217 N170 1k
R439 N218 N163 1k
R440 N175 N208 150
XU153 N208 N176 VSS+ VSS- N177 LT1001  ; pins In+ In- V+ V- OUT
R441 N176 N177 680
R442 N177 N207 150
R443 VGND N176 330
XU154 VOUT1 N149 VSS+ VSS- N149 LT1001  ; pins In+ In- V+ V- OUT
M26 N357 Wc N332 N357 NMOS
C12 N357 VGND {C} IC=0
XU155 VGND N340 VSS+ VSS- N341 LT1001  ; pins In+ In- V+ V- OUT
R444 N341 N340 1k
R445 N340 N303 1k
R446 N340 N350 1k
XU156 VGND N331 VSS+ VSS- N332 LT1001  ; pins In+ In- V+ V- OUT
R447 N331 N332 1k
R448 N341 N331 1k
XU157 N357 N350 VSS+ VSS- N350 LT1001  ; pins In+ In- V+ V- OUT
XU158 N357 N271 VSS+ VSS- N271 LT1001  ; pins In+ In- V+ V- OUT
R449 N293 N329 {LRB}
R450 N329 VGND {LR}
XU159 ERRORSIG2 N330 VSS+ VSS- N330 LT1001  ; pins In+ In- V+ V- OUT
D145 N300 N295 RB511VM-40
XU160 VGND N294 VSS+ VSS- N295 LT1001  ; pins In+ In- V+ V- OUT
R451 N294 N295 1k
R452 N245 N294 1k
D146 N300 N330 RB511VM-40
D147 N295 N348 RB511VM-40
D148 N330 N348 RB511VM-40
R453 VDD N300 500k
R454 N348 VGND 50k
D149 N288 N330 RB511VM-40
D150 N288 N245 RB511VM-40
D151 N330 N349 RB511VM-40
D152 N245 N349 RB511VM-40
R455 VDD N288 500k
R456 N349 VGND 50k
XU161 N289 N301 VSS+ VSS- N304 LT1001  ; pins In+ In- V+ V- OUT
R457 N301 N304 1k
R458 VGND N289 1k
R459 N301 N300 5k
R460 N301 N349 5k
R461 N289 N288 5k
R462 N289 N348 5k
R463 N348 N300 1k
R464 N349 N288 1k
R465 N304 N342 150
XU162 N342 N302 VSS+ VSS- N303 LT1001  ; pins In+ In- V+ V- OUT
R466 N302 N303 680
R467 VGND N302 330
XU163 N329 N245 VSS+ VSS- N245 LT1001  ; pins In+ In- V+ V- OUT
XU164 N351 T22 VSS+ VSS- T22 LT1001  ; pins In+ In- V+ V- OUT
D153 N314 N306 RB511VM-40
XU165 VGND N305 VSS+ VSS- N306 LT1001  ; pins In+ In- V+ V- OUT
R468 N305 N306 1k
R469 N271 N305 1k
D154 N314 N293 RB511VM-40
D155 N306 N361 RB511VM-40
D156 N293 N361 RB511VM-40
R470 VDD N314 500k
R471 N361 VGND 50k
D157 N307 N293 RB511VM-40
D158 N307 N271 RB511VM-40
D159 N293 N362 RB511VM-40
D160 N271 N362 RB511VM-40
R472 VDD N307 500k
R473 N362 VGND 50k
XU166 N308 N315 VSS+ VSS- N319 LT1001  ; pins In+ In- V+ V- OUT
R474 N315 N319 1k
R475 VGND N308 1k
R476 N315 N314 5k
R477 N315 N362 5k
R478 N308 N307 5k
R479 N308 N361 5k
R480 N361 N314 1k
R481 N362 N307 1k
R482 N319 N352 150
XU167 N352 N320 VSS+ VSS- N321 LT1001  ; pins In+ In- V+ V- OUT
R483 N320 N321 680
R484 N321 N351 150
R485 VGND N320 330
XU168 VOUT2 N293 VSS+ VSS- N293 LT1001  ; pins In+ In- V+ V- OUT
M27 N501 Wc N476 N501 NMOS
C13 N501 VGND {C} IC=0
XU169 VGND N484 VSS+ VSS- N485 LT1001  ; pins In+ In- V+ V- OUT
R486 N485 N484 1k
R487 N484 N447 1k
R488 N484 N494 1k
XU170 VGND N475 VSS+ VSS- N476 LT1001  ; pins In+ In- V+ V- OUT
R489 N475 N476 1k
R490 N485 N475 1k
XU171 N501 N494 VSS+ VSS- N494 LT1001  ; pins In+ In- V+ V- OUT
XU172 N501 N415 VSS+ VSS- N415 LT1001  ; pins In+ In- V+ V- OUT
R491 N437 N473 {LRB}
R492 N473 VGND {LR}
XU173 ERRORSIG2 N474 VSS+ VSS- N474 LT1001  ; pins In+ In- V+ V- OUT
D161 N444 N439 RB511VM-40
XU174 VGND N438 VSS+ VSS- N439 LT1001  ; pins In+ In- V+ V- OUT
R493 N438 N439 1k
R494 N389 N438 1k
D162 N444 N474 RB511VM-40
D163 N439 N492 RB511VM-40
D164 N474 N492 RB511VM-40
R495 VDD N444 500k
R496 N492 VGND 50k
D165 N432 N474 RB511VM-40
D166 N432 N389 RB511VM-40
D167 N474 N493 RB511VM-40
D168 N389 N493 RB511VM-40
R497 VDD N432 500k
R498 N493 VGND 50k
XU175 N433 N445 VSS+ VSS- N448 LT1001  ; pins In+ In- V+ V- OUT
R499 N445 N448 1k
R500 VGND N433 1k
R501 N445 N444 5k
R502 N445 N493 5k
R503 N433 N432 5k
R504 N433 N492 5k
R505 N492 N444 1k
R506 N493 N432 1k
R507 N448 N486 150
XU176 N486 N446 VSS+ VSS- N447 LT1001  ; pins In+ In- V+ V- OUT
R508 N446 N447 680
R509 VGND N446 330
XU177 N473 N389 VSS+ VSS- N389 LT1001  ; pins In+ In- V+ V- OUT
XU178 N495 T32 VSS+ VSS- T32 LT1001  ; pins In+ In- V+ V- OUT
D169 N458 N450 RB511VM-40
XU179 VGND N449 VSS+ VSS- N450 LT1001  ; pins In+ In- V+ V- OUT
R510 N449 N450 1k
R511 N415 N449 1k
D170 N458 N437 RB511VM-40
D171 N450 N505 RB511VM-40
D172 N437 N505 RB511VM-40
R512 VDD N458 500k
R513 N505 VGND 50k
D173 N451 N437 RB511VM-40
D174 N451 N415 RB511VM-40
D175 N437 N506 RB511VM-40
D176 N415 N506 RB511VM-40
R514 VDD N451 500k
R515 N506 VGND 50k
XU180 N452 N459 VSS+ VSS- N463 LT1001  ; pins In+ In- V+ V- OUT
R516 N459 N463 1k
R517 VGND N452 1k
R518 N459 N458 5k
R519 N459 N506 5k
R520 N452 N451 5k
R521 N452 N505 5k
R522 N505 N458 1k
R523 N506 N451 1k
R524 N463 N496 150
XU181 N496 N464 VSS+ VSS- N465 LT1001  ; pins In+ In- V+ V- OUT
R525 N464 N465 680
R526 N465 N495 150
R527 VGND N464 330
XU182 VOUT3 N437 VSS+ VSS- N437 LT1001  ; pins In+ In- V+ V- OUT
M28 N645 Wc N620 N645 NMOS
C14 N645 VGND {C} IC=0
XU183 VGND N628 VSS+ VSS- N629 LT1001  ; pins In+ In- V+ V- OUT
R528 N629 N628 1k
R529 N628 N591 1k
R530 N628 N638 1k
XU184 VGND N619 VSS+ VSS- N620 LT1001  ; pins In+ In- V+ V- OUT
R531 N619 N620 1k
R532 N629 N619 1k
XU185 N645 N638 VSS+ VSS- N638 LT1001  ; pins In+ In- V+ V- OUT
XU186 N645 N559 VSS+ VSS- N559 LT1001  ; pins In+ In- V+ V- OUT
R533 N581 N617 {LRB}
R534 N617 VGND {LR}
XU187 ERRORSIG2 N618 VSS+ VSS- N618 LT1001  ; pins In+ In- V+ V- OUT
D177 N588 N583 RB511VM-40
XU188 VGND N582 VSS+ VSS- N583 LT1001  ; pins In+ In- V+ V- OUT
R535 N582 N583 1k
R536 N533 N582 1k
D178 N588 N618 RB511VM-40
D179 N583 N636 RB511VM-40
D180 N618 N636 RB511VM-40
R537 VDD N588 500k
R538 N636 VGND 50k
D181 N576 N618 RB511VM-40
D182 N576 N533 RB511VM-40
D183 N618 N637 RB511VM-40
D184 N533 N637 RB511VM-40
R539 VDD N576 500k
R540 N637 VGND 50k
XU189 N577 N589 VSS+ VSS- N592 LT1001  ; pins In+ In- V+ V- OUT
R541 N589 N592 1k
R542 VGND N577 1k
R543 N589 N588 5k
R544 N589 N637 5k
R545 N577 N576 5k
R546 N577 N636 5k
R547 N636 N588 1k
R548 N637 N576 1k
R549 N592 N630 150
XU190 N630 N590 VSS+ VSS- N591 LT1001  ; pins In+ In- V+ V- OUT
R550 N590 N591 680
R551 VGND N590 330
XU191 N617 N533 VSS+ VSS- N533 LT1001  ; pins In+ In- V+ V- OUT
XU192 N639 T42 VSS+ VSS- T42 LT1001  ; pins In+ In- V+ V- OUT
D185 N602 N594 RB511VM-40
XU193 VGND N593 VSS+ VSS- N594 LT1001  ; pins In+ In- V+ V- OUT
R552 N593 N594 1k
R553 N559 N593 1k
D186 N602 N581 RB511VM-40
D187 N594 N649 RB511VM-40
D188 N581 N649 RB511VM-40
R554 VDD N602 500k
R555 N649 VGND 50k
D189 N595 N581 RB511VM-40
D190 N595 N559 RB511VM-40
D191 N581 N650 RB511VM-40
D192 N559 N650 RB511VM-40
R556 VDD N595 500k
R557 N650 VGND 50k
XU194 N596 N603 VSS+ VSS- N607 LT1001  ; pins In+ In- V+ V- OUT
R558 N603 N607 1k
R559 VGND N596 1k
R560 N603 N602 5k
R561 N603 N650 5k
R562 N596 N595 5k
R563 N596 N649 5k
R564 N649 N602 1k
R565 N650 N595 1k
R566 N607 N640 150
XU195 N640 N608 VSS+ VSS- N609 LT1001  ; pins In+ In- V+ V- OUT
R567 N608 N609 680
R568 N609 N639 150
R569 VGND N608 330
XU196 VOUT4 N581 VSS+ VSS- N581 LT1001  ; pins In+ In- V+ V- OUT
M29 N224 Wc N212 N224 NMOS
C15 N224 VGND {C} IC=0
XU197 VGND N214 VSS+ VSS- N215 LT1001  ; pins In+ In- V+ V- OUT
R570 N215 N214 1k
R571 N214 N190 1k
R572 N214 N221 1k
XU198 VGND N211 VSS+ VSS- N212 LT1001  ; pins In+ In- V+ V- OUT
R573 N211 N212 1k
R574 N215 N211 1k
XU199 N224 N221 VSS+ VSS- N221 LT1001  ; pins In+ In- V+ V- OUT
XU200 N224 N152 VSS+ VSS- N152 LT1001  ; pins In+ In- V+ V- OUT
R575 N178 N209 {LRB}
R576 N209 VGND {LR}
XU201 ERRORSIG2 N210 VSS+ VSS- N210 LT1001  ; pins In+ In- V+ V- OUT
D193 N183 N180 RB511VM-40
XU202 VGND N179 VSS+ VSS- N180 LT1001  ; pins In+ In- V+ V- OUT
R577 N179 N180 1k
R578 N129 N179 1k
D194 N183 N210 RB511VM-40
D195 N180 N219 RB511VM-40
D196 N210 N219 RB511VM-40
R579 VDD N183 500k
R580 N219 VGND 50k
D197 N172 N210 RB511VM-40
D198 N172 N129 RB511VM-40
D199 N210 N220 RB511VM-40
D200 N129 N220 RB511VM-40
R581 VDD N172 500k
R582 N220 VGND 50k
XU203 N173 N184 VSS+ VSS- N191 LT1001  ; pins In+ In- V+ V- OUT
R583 N184 N191 1k
R584 VGND N173 1k
R585 N184 N183 5k
R586 N184 N220 5k
R587 N173 N172 5k
R588 N173 N219 5k
R589 N219 N183 1k
R590 N220 N172 1k
R591 N191 N216 150
XU204 N216 N189 VSS+ VSS- N190 LT1001  ; pins In+ In- V+ V- OUT
R592 N189 N190 680
R593 VGND N189 330
XU205 N209 N129 VSS+ VSS- N129 LT1001  ; pins In+ In- V+ V- OUT
XU206 N222 T52 VSS+ VSS- T52 LT1001  ; pins In+ In- V+ V- OUT
D201 N199 N193 RB511VM-40
XU207 VGND N192 VSS+ VSS- N193 LT1001  ; pins In+ In- V+ V- OUT
R594 N192 N193 1k
R595 N152 N192 1k
D202 N199 N178 RB511VM-40
D203 N193 N225 RB511VM-40
D204 N178 N225 RB511VM-40
R596 VDD N199 500k
R597 N225 VGND 50k
D205 N194 N178 RB511VM-40
D206 N194 N152 RB511VM-40
D207 N178 N226 RB511VM-40
D208 N152 N226 RB511VM-40
R598 VDD N194 500k
R599 N226 VGND 50k
XU208 N195 N200 VSS+ VSS- N201 LT1001  ; pins In+ In- V+ V- OUT
R600 N200 N201 1k
R601 VGND N195 1k
R602 N200 N199 5k
R603 N200 N226 5k
R604 N195 N194 5k
R605 N195 N225 5k
R606 N225 N199 1k
R607 N226 N194 1k
R608 N201 N223 150
XU209 N223 N202 VSS+ VSS- N203 LT1001  ; pins In+ In- V+ V- OUT
R609 N202 N203 680
R610 N203 N222 150
R611 VGND N202 330
XU210 VOUT5 N178 VSS+ VSS- N178 LT1001  ; pins In+ In- V+ V- OUT
M30 N368 Wc N356 N368 NMOS
C16 N368 VGND {C} IC=0
XU211 VGND N358 VSS+ VSS- N359 LT1001  ; pins In+ In- V+ V- OUT
R612 N359 N358 1k
R613 N358 N334 1k
R614 N358 N365 1k
XU212 VGND N355 VSS+ VSS- N356 LT1001  ; pins In+ In- V+ V- OUT
R615 N355 N356 1k
R616 N359 N355 1k
XU213 N368 N365 VSS+ VSS- N365 LT1001  ; pins In+ In- V+ V- OUT
XU214 N368 N296 VSS+ VSS- N296 LT1001  ; pins In+ In- V+ V- OUT
R617 N322 N353 {LRB}
R618 N353 VGND {LR}
XU215 ERRORSIG2 N354 VSS+ VSS- N354 LT1001  ; pins In+ In- V+ V- OUT
D209 N327 N324 RB511VM-40
XU216 VGND N323 VSS+ VSS- N324 LT1001  ; pins In+ In- V+ V- OUT
R619 N323 N324 1k
R620 N273 N323 1k
D210 N327 N354 RB511VM-40
D211 N324 N363 RB511VM-40
D212 N354 N363 RB511VM-40
R621 VDD N327 500k
R622 N363 VGND 50k
D213 N316 N354 RB511VM-40
D214 N316 N273 RB511VM-40
D215 N354 N364 RB511VM-40
D216 N273 N364 RB511VM-40
R623 VDD N316 500k
R624 N364 VGND 50k
XU217 N317 N328 VSS+ VSS- N335 LT1001  ; pins In+ In- V+ V- OUT
R625 N328 N335 1k
R626 VGND N317 1k
R627 N328 N327 5k
R628 N328 N364 5k
R629 N317 N316 5k
R630 N317 N363 5k
R631 N363 N327 1k
R632 N364 N316 1k
R633 N335 N360 150
XU218 N360 N333 VSS+ VSS- N334 LT1001  ; pins In+ In- V+ V- OUT
R634 N333 N334 680
R635 VGND N333 330
XU219 N353 N273 VSS+ VSS- N273 LT1001  ; pins In+ In- V+ V- OUT
XU220 N366 T62 VSS+ VSS- T62 LT1001  ; pins In+ In- V+ V- OUT
D217 N343 N337 RB511VM-40
XU221 VGND N336 VSS+ VSS- N337 LT1001  ; pins In+ In- V+ V- OUT
R636 N336 N337 1k
R637 N296 N336 1k
D218 N343 N322 RB511VM-40
D219 N337 N369 RB511VM-40
D220 N322 N369 RB511VM-40
R638 VDD N343 500k
R639 N369 VGND 50k
D221 N338 N322 RB511VM-40
D222 N338 N296 RB511VM-40
D223 N322 N370 RB511VM-40
D224 N296 N370 RB511VM-40
R640 VDD N338 500k
R641 N370 VGND 50k
XU222 N339 N344 VSS+ VSS- N345 LT1001  ; pins In+ In- V+ V- OUT
R642 N344 N345 1k
R643 VGND N339 1k
R644 N344 N343 5k
R645 N344 N370 5k
R646 N339 N338 5k
R647 N339 N369 5k
R648 N369 N343 1k
R649 N370 N338 1k
R650 N345 N367 150
XU223 N367 N346 VSS+ VSS- N347 LT1001  ; pins In+ In- V+ V- OUT
R651 N346 N347 680
R652 N347 N366 150
R653 VGND N346 330
XU224 VOUT6 N322 VSS+ VSS- N322 LT1001  ; pins In+ In- V+ V- OUT
M31 N512 Wc N500 N512 NMOS
C17 N512 VGND {C} IC=0
XU225 VGND N502 VSS+ VSS- N503 LT1001  ; pins In+ In- V+ V- OUT
R654 N503 N502 1k
R655 N502 N478 1k
R656 N502 N509 1k
XU226 VGND N499 VSS+ VSS- N500 LT1001  ; pins In+ In- V+ V- OUT
R657 N499 N500 1k
R658 N503 N499 1k
XU227 N512 N509 VSS+ VSS- N509 LT1001  ; pins In+ In- V+ V- OUT
XU228 N512 N440 VSS+ VSS- N440 LT1001  ; pins In+ In- V+ V- OUT
R659 N466 N497 {LRB}
R660 N497 VGND {LR}
XU229 ERRORSIG2 N498 VSS+ VSS- N498 LT1001  ; pins In+ In- V+ V- OUT
D225 N471 N468 RB511VM-40
XU230 VGND N467 VSS+ VSS- N468 LT1001  ; pins In+ In- V+ V- OUT
R661 N467 N468 1k
R662 N417 N467 1k
D226 N471 N498 RB511VM-40
D227 N468 N507 RB511VM-40
D228 N498 N507 RB511VM-40
R663 VDD N471 500k
R664 N507 VGND 50k
D229 N460 N498 RB511VM-40
D230 N460 N417 RB511VM-40
D231 N498 N508 RB511VM-40
D232 N417 N508 RB511VM-40
R665 VDD N460 500k
R666 N508 VGND 50k
XU231 N461 N472 VSS+ VSS- N479 LT1001  ; pins In+ In- V+ V- OUT
R667 N472 N479 1k
R668 VGND N461 1k
R669 N472 N471 5k
R670 N472 N508 5k
R671 N461 N460 5k
R672 N461 N507 5k
R673 N507 N471 1k
R674 N508 N460 1k
R675 N479 N504 150
XU232 N504 N477 VSS+ VSS- N478 LT1001  ; pins In+ In- V+ V- OUT
R676 N477 N478 680
R677 VGND N477 330
XU233 N497 N417 VSS+ VSS- N417 LT1001  ; pins In+ In- V+ V- OUT
XU234 N510 T72 VSS+ VSS- T72 LT1001  ; pins In+ In- V+ V- OUT
D233 N487 N481 RB511VM-40
XU235 VGND N480 VSS+ VSS- N481 LT1001  ; pins In+ In- V+ V- OUT
R678 N480 N481 1k
R679 N440 N480 1k
D234 N487 N466 RB511VM-40
D235 N481 N513 RB511VM-40
D236 N466 N513 RB511VM-40
R680 VDD N487 500k
R681 N513 VGND 50k
D237 N482 N466 RB511VM-40
D238 N482 N440 RB511VM-40
D239 N466 N514 RB511VM-40
D240 N440 N514 RB511VM-40
R682 VDD N482 500k
R683 N514 VGND 50k
XU236 N483 N488 VSS+ VSS- N489 LT1001  ; pins In+ In- V+ V- OUT
R684 N488 N489 1k
R685 VGND N483 1k
R686 N488 N487 5k
R687 N488 N514 5k
R688 N483 N482 5k
R689 N483 N513 5k
R690 N513 N487 1k
R691 N514 N482 1k
R692 N489 N511 150
XU237 N511 N490 VSS+ VSS- N491 LT1001  ; pins In+ In- V+ V- OUT
R693 N490 N491 680
R694 N491 N510 150
R695 VGND N490 330
XU238 VOUT7 N466 VSS+ VSS- N466 LT1001  ; pins In+ In- V+ V- OUT
M32 N656 Wc N644 N656 NMOS
C18 N656 VGND {C} IC=0
XU239 VGND N646 VSS+ VSS- N647 LT1001  ; pins In+ In- V+ V- OUT
R696 N647 N646 1k
R697 N646 N622 1k
R698 N646 N653 1k
XU240 VGND N643 VSS+ VSS- N644 LT1001  ; pins In+ In- V+ V- OUT
R699 N643 N644 1k
R700 N647 N643 1k
XU241 N656 N653 VSS+ VSS- N653 LT1001  ; pins In+ In- V+ V- OUT
XU242 N656 N584 VSS+ VSS- N584 LT1001  ; pins In+ In- V+ V- OUT
R701 N610 N641 {LRB}
R702 N641 VGND {LR}
XU243 ERRORSIG2 N642 VSS+ VSS- N642 LT1001  ; pins In+ In- V+ V- OUT
D241 N615 N612 RB511VM-40
XU244 VGND N611 VSS+ VSS- N612 LT1001  ; pins In+ In- V+ V- OUT
R703 N611 N612 1k
R704 N561 N611 1k
D242 N615 N642 RB511VM-40
D243 N612 N651 RB511VM-40
D244 N642 N651 RB511VM-40
R705 VDD N615 500k
R706 N651 VGND 50k
D245 N604 N642 RB511VM-40
D246 N604 N561 RB511VM-40
D247 N642 N652 RB511VM-40
D248 N561 N652 RB511VM-40
R707 VDD N604 500k
R708 N652 VGND 50k
XU245 N605 N616 VSS+ VSS- N623 LT1001  ; pins In+ In- V+ V- OUT
R709 N616 N623 1k
R710 VGND N605 1k
R711 N616 N615 5k
R712 N616 N652 5k
R713 N605 N604 5k
R714 N605 N651 5k
R715 N651 N615 1k
R716 N652 N604 1k
R717 N623 N648 150
XU246 N648 N621 VSS+ VSS- N622 LT1001  ; pins In+ In- V+ V- OUT
R718 N621 N622 680
R719 VGND N621 330
XU247 N641 N561 VSS+ VSS- N561 LT1001  ; pins In+ In- V+ V- OUT
XU248 N654 T82 VSS+ VSS- T82 LT1001  ; pins In+ In- V+ V- OUT
D249 N631 N625 RB511VM-40
XU249 VGND N624 VSS+ VSS- N625 LT1001  ; pins In+ In- V+ V- OUT
R720 N624 N625 1k
R721 N584 N624 1k
D250 N631 N610 RB511VM-40
D251 N625 N657 RB511VM-40
D252 N610 N657 RB511VM-40
R722 VDD N631 500k
R723 N657 VGND 50k
D253 N626 N610 RB511VM-40
D254 N626 N584 RB511VM-40
D255 N610 N658 RB511VM-40
D256 N584 N658 RB511VM-40
R724 VDD N626 500k
R725 N658 VGND 50k
XU250 N627 N632 VSS+ VSS- N633 LT1001  ; pins In+ In- V+ V- OUT
R726 N632 N633 1k
R727 VGND N627 1k
R728 N632 N631 5k
R729 N632 N658 5k
R730 N627 N626 5k
R731 N627 N657 5k
R732 N657 N631 1k
R733 N658 N626 1k
R734 N633 N655 150
XU251 N655 N634 VSS+ VSS- N635 LT1001  ; pins In+ In- V+ V- OUT
R735 N634 N635 680
R736 N635 N654 150
R737 VGND N634 330
XU252 VOUT8 N610 VSS+ VSS- N610 LT1001  ; pins In+ In- V+ V- OUT
.model D D
.lib standard.dio
.model NMOS NMOS
.model PMOS PMOS
.lib standard.mos
.tran 1
.option noopiter
.param LR=1k
.param LRB=1K
.param c=1u
.lib LTC.lib
.backanno
.end